# Altium schematic sheet DATN2022.Datalogger.Hardware.SchDoc
size A
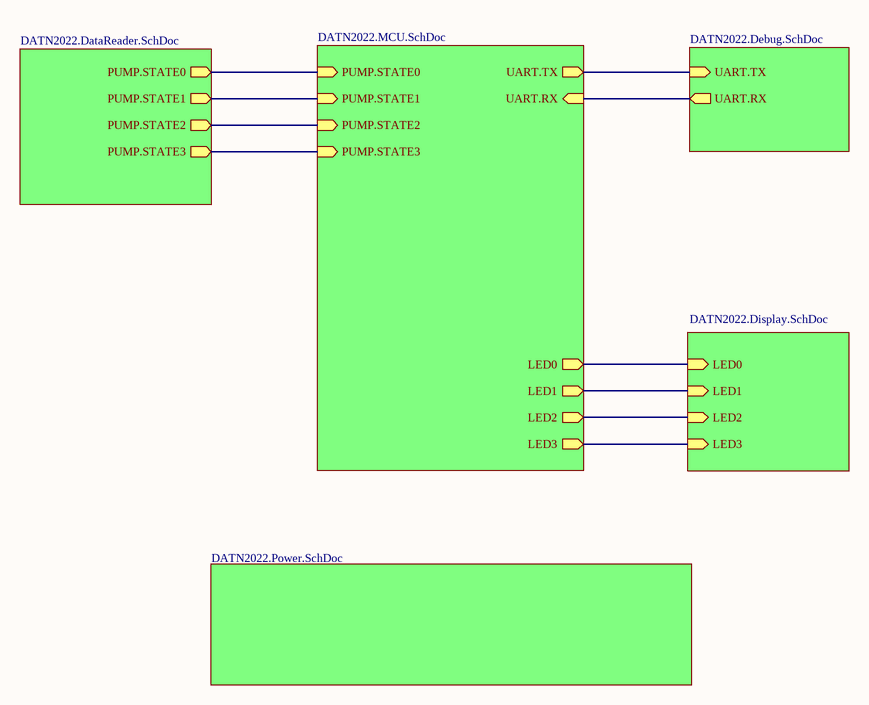
[diagram p0: DATN2022.Datalogger.Hardware.SchDoc]

## Sub-sheets
? = DATN2022.Power.SchDoc: no entries
? = DATN2022.MCU.SchDoc: PUMP.STATE0 (in), PUMP.STATE1 (in), PUMP.STATE2 (in), PUMP.STATE3 (in), UART.TX (out), UART.RX (in), LED0 (out), LED1 (out), LED2 (out), LED3 (out)
? = DATN2022.DataReader.SchDoc: PUMP.STATE0 (out), PUMP.STATE1 (out), PUMP.STATE2 (out), PUMP.STATE3 (out)
? = DATN2022.Debug.SchDoc: UART.TX (in), UART.RX (out)
? = DATN2022.Display.SchDoc: LED0 (in), LED1 (in), LED2 (in), LED3 (in)

## Nets
(unnamed): sheet /PUMP.STATE0, sheet /PUMP.STATE0
(unnamed): sheet /PUMP.STATE1, sheet /PUMP.STATE1
(unnamed): sheet /PUMP.STATE2, sheet /PUMP.STATE2
(unnamed): sheet /PUMP.STATE3, sheet /PUMP.STATE3
(unnamed): sheet /UART.TX, sheet /UART.TX
(unnamed): sheet /UART.RX, sheet /UART.RX
(unnamed): sheet /LED0, sheet /LED0
(unnamed): sheet /LED1, sheet /LED1
(unnamed): sheet /LED2, sheet /LED2
(unnamed): sheet /LED3, sheet /LED3